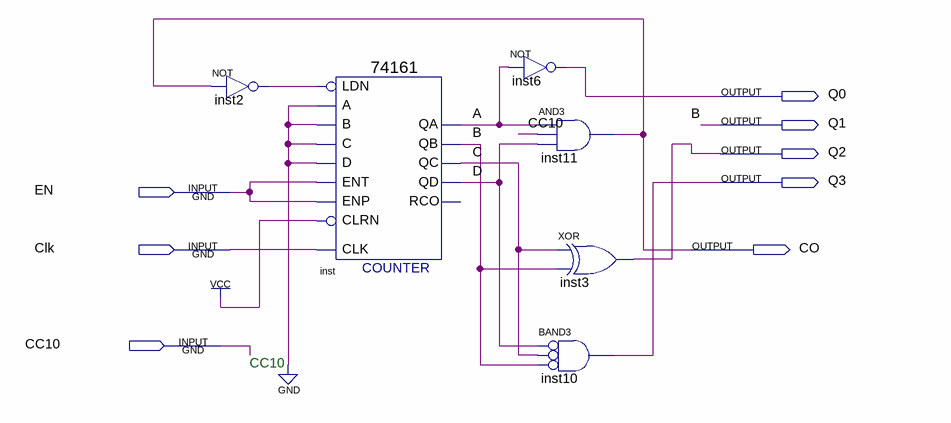
[diagram p0: schematic sheet]
// Quartus schematic M10.bdf as structural Verilog: 6 symbols, 8 pins
module M10 (
  input  EN,
  input  Clk,
  input  CC10,
  output Q0,
  output Q1,
  output Q2,
  output Q3,
  output CO
);

  wire A, C, D, inst2_out;

  not inst2 (inst2_out, CO);
  \74161  inst (
    .CLRN(1'b1), .CLK(Clk), .ENP(EN), .LDN(inst2_out), .A(1'b0), .D(1'b0), .ENT(EN), .B(1'b0), .C(1'b0),
    .QD(D), .QC(C), .QB(Q1), .QA(A));  // open: RCO
  not inst6 (Q0, A);
  and inst11 (CO, A, CC10, D);
  xor inst3 (Q2, C, Q1);
  and inst10 (Q3, ~D, ~C, ~Q1);  // BAND3

  // Other names for the same wires on the sheet: B = Q1

  // Notes on the sheet:
  //   CC10
endmodule
